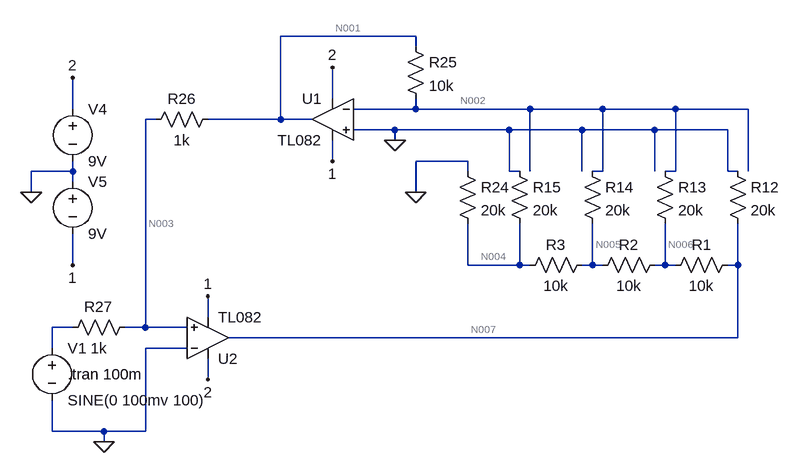
[diagram p0: schematic sxematic.asc]
* sxematic.asc
R2 N006 N005 10k
R3 N005 N004 10k
R1 N007 N006 10k
R24 0 N004 20k
R25 N001 N002 10k
R26 N001 N003 1k
R27 N003 N008 1k
R15 0 N004 20k
R14 N002 N005 20k
R13 N002 N006 20k
R12 0 N007 20k
V1 N008 0 SINE(0 100mv 100)
* U1: TL082 (symbol TL082 not available, pins judged from their places): In+=0 In-=N002 V+=2 V-=1 OUT=N001
* U2: TL082 (symbol TL082 not available, pins judged from their places): In+=N003 In-=0 V+=2 V-=1 OUT=N007
V4 2 0 9V
V5 0 1 9V
.tran 100m
.backanno
.end

* Results of the author's LTspice run, read from the files saved beside the schematic
* Operating Point, zero values left out:
*   V(n006) = 57.15 µV
*   V(n005) = 31.32 µV
*   V(n004) = 15.66 µV
*   V(n007) = 106.1 µV
*   V(n001) = -21.9 µV
*   V(n002) = 10.97 µV
*   V(n003) = -10.97 µV
*   V(1) = -9 V
*   V(2) = 9 V
*   I(R12) = -5.304 nA
*   I(R13) = -2.309 nA
*   I(R14) = -1.017 nA
*   I(R15) = -782.9 pA
*   I(R27) = -10.97 nA
*   I(R26) = -10.93 nA
*   I(R25) = -3.287 nA
*   I(R24) = -782.9 pA
*   I(R1) = 4.892 nA
*   I(R3) = 1.566 nA
*   I(R2) = 2.583 nA
*   I(V5) = -17.19 mA
*   I(V4) = -17.19 mA
*   I(V1) = -10.97 nA
*   Ix(u1:1) = 39.05 pA
*   Ix(u1:2) = 39.05 pA
*   Ix(u1:3) = 8.594 mA
*   Ix(u1:4) = -8.595 mA
*   Ix(u1:5) = 14.22 nA
*   Ix(u2:1) = 39.05 pA
*   Ix(u2:2) = 39.05 pA
*   Ix(u2:3) = 8.594 mA
*   Ix(u2:4) = -8.595 mA
*   Ix(u2:5) = -10.2 nA
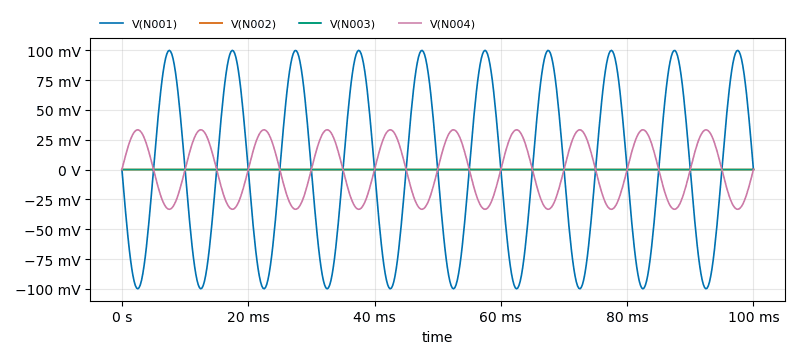
[diagram p1: Transient Analysis of sxematic.asc, plotted from the saved traces]
* Transient Analysis, 1 run:
*   V(N001): min -99.93 mV, max 99.88 mV, average -21.76 µV, rms 70.65 mV, last -6.201 µV
*   V(N002): min 7.545 µV, max 14.42 µV, average 10.97 µV, rms 11.24 µV, last 14.35 µV
*   V(N003): min -18.91 µV, max -2.993 µV, average -10.97 µV, rms 12.32 µV, last -3.12 µV
*   V(N004): min -33.29 mV, max 33.32 mV, average 15.61 µV, rms 23.55 mV, last 12.96 µV